# EAGLE design Converter (EAGLE 9.2.2)

## Sheet 1 of 3: Connectors & Caps
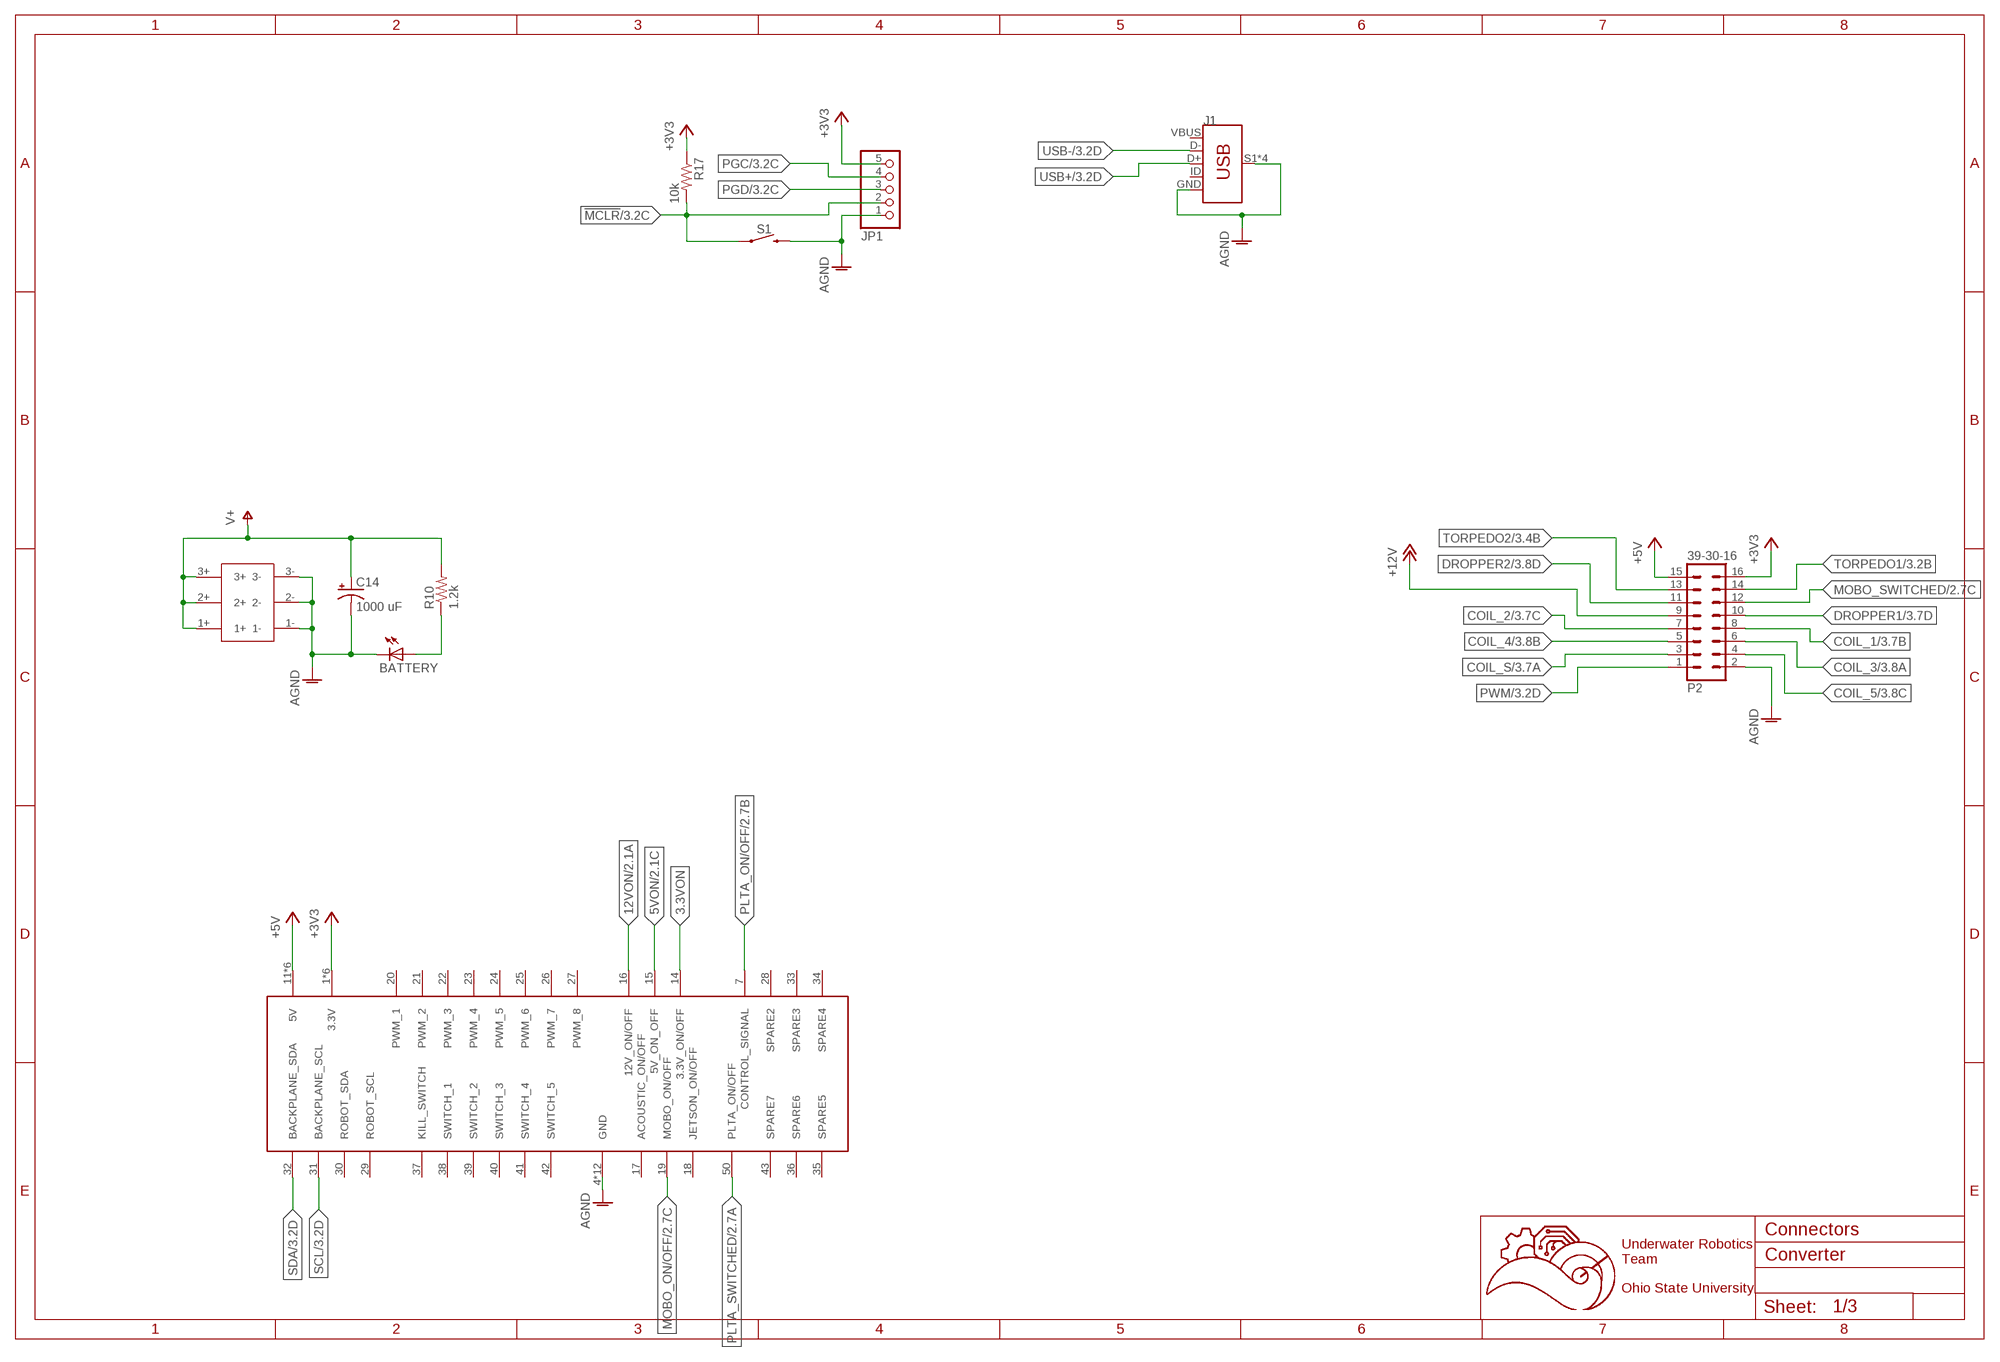
[diagram p0: schematic, sheet 1]

### Parts
BATTERY  LEDCHIPLED_0603  [CHIPLED_0603]
C14  1000 uF  CPOL-USE5-13  [E5-13]
J1  USB_MINI-B_SMT  [USB-MINIB]
JP1  PINHD-1X55X2MM  [1_05X2MM]
P2  39-30-16  [39-30-?16?]
R10  1.2k  R-US_R0805  [R0805]
R17  10k  R-US_R0603  [R0603]
S1  MOMENTARY-SWITCH-SPST-PTH-6.0MM  [TACTILE_SWITCH_PTH_6.0MM]
U$1  5530843-EDGE  [5530843-6-BOARDFINGERS]
U$3  6PIN-VERT  [6PIN_VERT]

### Nets
3.3VON: U$1.14(3.3V_ON/OFF)
5VON: U$1.15(5V_ON_OFF) ; also sheet 2
12VON: U$1.16(12V_ON/OFF) ; also sheet 2
!MCLR!: JP1.2 R17.2 S1.1 ; also sheet 3
+3V3: JP1.5 P2.16 R17.1 U$1.1(3.3V) U$1.2(3.3V) U$1.3(3.3V) U$1.54(3.3V) U$1.55(3.3V) U$1.56(3.3V) ; also sheet 2,3
+5V: P2.15 U$1.11(5V) U$1.12(5V) U$1.13(5V) U$1.44(5V) U$1.45(5V) U$1.46(5V) ; also sheet 2
+12V: P2.9 ; also sheet 2,3
AGND: BATTERY.C C14.- J1.GND J1.S1(SHIELD) J1.S2(SHIELD) J1.S3(SHIELD) J1.S4(SHIELD) JP1.1 P2.2 S1.3 U$1.4(GND) U$1.5(GND) U$1.6(GND) U$1.8(GND) U$1.9(GND) U$1.10(GND) U$1.47(GND) U$1.48(GND) U$1.49(GND) U$1.51(GND) U$1.52(GND) U$1.53(GND) U$3.1- U$3.2- U$3.3- ; also sheet 2,3
COIL_1: P2.8 ; also sheet 3
COIL_2: P2.7 ; also sheet 3
COIL_3: P2.6 ; also sheet 3
COIL_4: P2.5 ; also sheet 3
COIL_5: P2.4 ; also sheet 3
COIL_S: P2.3 ; also sheet 3
DROPPER1: P2.10 ; also sheet 3
DROPPER2: P2.11 ; also sheet 3
MOBO_ON/OFF: U$1.19(MOBO_ON/OFF) ; also sheet 2
MOBO_SWITCHED: P2.12 ; also sheet 2
N$9: BATTERY.A R10.1
PGC: JP1.4 ; also sheet 3
PGD: JP1.3 ; also sheet 3
PLTA_ON/OFF: U$1.7(CONTROL_SIGNAL) ; also sheet 2
PLTA_SWITCHED: U$1.50(PLTA_ON/OFF) ; also sheet 2
PWM: P2.1 ; also sheet 3
SCL: U$1.31(BACKPLANE_SCL) ; also sheet 3
SDA: U$1.32(BACKPLANE_SDA) ; also sheet 3
TORPEDO1: P2.14 ; also sheet 3
TORPEDO2: P2.13 ; also sheet 3
USB+: J1.D+ ; also sheet 3
USB-: J1.D- ; also sheet 3
V+: C14.+ R10.2 U$3.1+ U$3.2+ U$3.3+ ; also sheet 2
Unconnected: J1.ID U$1.17(ACOUSTIC_ON/OFF) U$1.18(JETSON_ON/OFF) U$1.20(PWM_1) U$1.21(PWM_2) U$1.22(PWM_3) U$1.23(PWM_4) U$1.24(PWM_5) U$1.25(PWM_6) U$1.26(PWM_7) U$1.27(PWM_8) U$1.28(SPARE2) U$1.29(ROBOT_SCL) U$1.30(ROBOT_SDA) U$1.33(SPARE3) U$1.34(SPARE4) U$1.35(SPARE5) U$1.36(SPARE6) U$1.37(KILL_SWITCH) U$1.38(SWITCH_1) U$1.39(SWITCH_2) U$1.40(SWITCH_3) U$1.41(SWITCH_4) U$1.42(SWITCH_5) U$1.43(SPARE7)

### Notes on the sheet
- Connectors
- Underwater Robotics
  Team
  
  Ohio State University

## Sheet 2 of 3: Converters
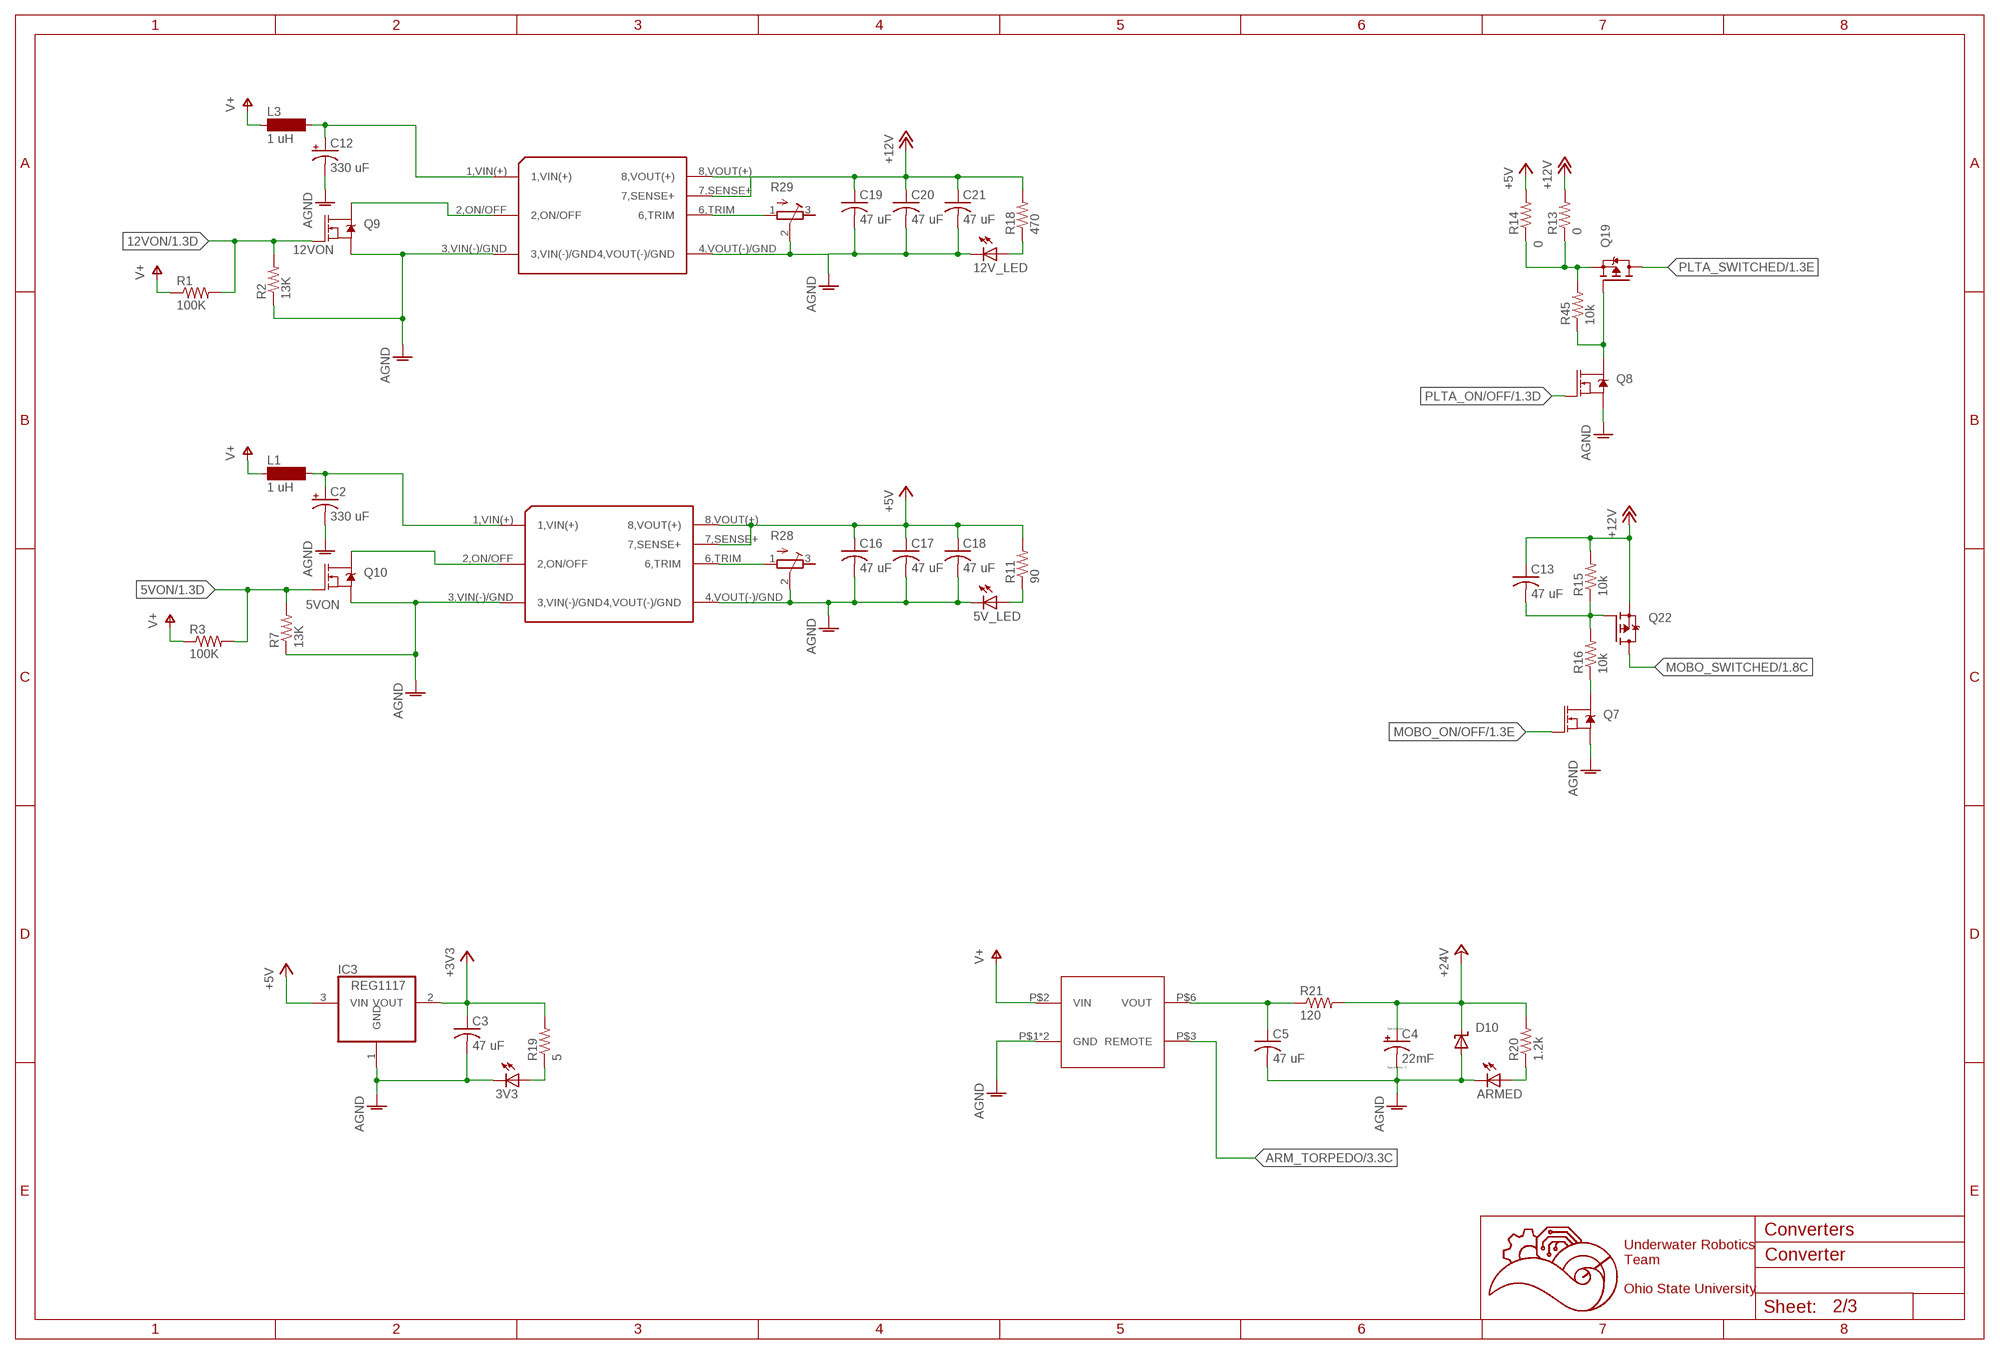
[diagram p1: schematic, sheet 2]

### Parts
3V3  LEDCHIPLED_0603  [CHIPLED_0603]
5V_LED  LEDCHIPLED_0603  [CHIPLED_0603]
5VCONVERTER  CONVERTER  [CONVERTER]
12V_LED  LEDCHIPLED_0603  [CHIPLED_0603]
12VCONVERTER  CONVERTER  [CONVERTER]
ARMED  LEDCHIPLED_0603  [CHIPLED_0603]
C2  330 uF  CPOL-USE5-10.5  [E5-10,5]
C3  47 uF  C-USC1206K  [C1206K]
C4  22mF  CPOL-USE10-30  [EB30D]
C5  47 uF  C-USC1206K  [C1206K]
C12  330 uF  CPOL-USE5-10.5  [E5-10,5]
C13  47 uF  C-USC1206K  [C1206K]
C16  47 uF  C-USC1206K  [C1206K]
C17  47 uF  C-USC1206K  [C1206K]
C18  47 uF  C-USC1206K  [C1206K]
C19  47 uF  C-USC1206K  [C1206K]
C20  47 uF  C-USC1206K  [C1206K]
C21  47 uF  C-USC1206K  [C1206K]
D10  SUPPRESSOR-SMBJ  [SMBJ]
IC3  REG1117  [SOT223]
L1  1 uH  MS85  [MS85]
L3  1 uH  MS85  [MS85]
Q7  MOSFET-NCH-AO3404A  [SOT23-3]
Q8  MOSFET-NCH-AO3404A  [SOT23-3]
Q9  MOSFET-NCH-AO3404A  [SOT23-3]
Q10  MOSFET-NCH-AO3404A  [SOT23-3]
Q19  FDD4141TO252  [TO252]
Q22  FDD4141TO252  [TO252]
R1  100K  R-US_R0603  [R0603]
R2  13K  R-US_R0603  [R0603]
R3  100K  R-US_R0603  [R0603]
R7  13K  R-US_R0603  [R0603]
R11  90  R-US_R0603  [R0603]
R13  0  R-US_M2309  [M2309]
R14  0  R-US_M2309  [M2309]
R15  10k  R-US_R0603  [R0603]
R16  10k  R-US_R0603  [R0603]
R18  470  R-US_R0603  [R0603]
R19  5  R-US_R0603  [R0603]
R20  1.2k  R-US_R0805  [R0805]
R21  120  R-US_R6332W  [R6332W]
R28  R-TRIMM3103  [RTRIM3103]
R29  R-TRIMM3103  [RTRIM3103]
R45  10k  R-US_R0603  [R0603]
U$6  TMR6-2415  [TMR6-2415]

### Nets
5VON: Q10.1(G) R3.2 R7.2 ; also sheet 1
12VON: Q9.1(G) R1.2 R2.2 ; also sheet 1
+3V3: C3.1 IC3.2(VOUT) R19.2 ; also sheet 1,3
+5V: 5VCONVERTER.7,SENSE+ 5VCONVERTER.8,VOUT(+) C16.1 C17.1 C18.1 IC3.3(VIN) R11.2 R14.2 ; also sheet 1
+12V: 12VCONVERTER.7,SENSE+ 12VCONVERTER.8,VOUT(+) C13.1 C19.1 C20.1 C21.1 Q22.2(S) R13.2 R15.2 R18.2 ; also sheet 1,3
+24V: C4.+ D10.C R20.2 R21.2 ; also sheet 3
AGND: 3V3.C 5V_LED.C 5VCONVERTER.3,VIN(-)/GND 5VCONVERTER.4,VOUT(-)/GND 12V_LED.C 12VCONVERTER.3,VIN(-)/GND 12VCONVERTER.4,VOUT(-)/GND ARMED.C C2.- C3.2 C4.- C5.2 C12.- C16.2 C17.2 C18.2 C19.2 C20.2 C21.2 D10.A IC3.1(GND) Q7.2(S) Q8.2(S) Q9.2(S) Q10.2(S) R2.1 R7.1 R28.2(S) R29.2(S) U$6.P$1(GND) U$6.P$7(GND) ; also sheet 1,3
ARM_TORPEDO: U$6.P$3(REMOTE) ; also sheet 3
MOBO_ON/OFF: Q7.1(G) ; also sheet 1
MOBO_SWITCHED: Q22.3(D) ; also sheet 1
N$1: 12VCONVERTER.6,TRIM R29.1(A)
N$2: 5VCONVERTER.6,TRIM R28.1(A)
N$3: 12VCONVERTER.1,VIN(+) C12.+ L3.2
N$5: 3V3.A R19.1
N$6: 5V_LED.A R11.1
N$7: 5VCONVERTER.1,VIN(+) C2.+ L1.2
N$8: 12V_LED.A R18.1
N$10: ARMED.A R20.1
N$11: C13.2 Q22.1(G) R15.1 R16.2
N$12: Q7.3(D) R16.1
N$13: Q19.2(S) R13.1 R14.1 R45.2
N$16: Q8.3(D) Q19.1(G) R45.1
N$18: 12VCONVERTER.2,ON/OFF Q9.3(D)
N$19: 5VCONVERTER.2,ON/OFF Q10.3(D)
N$26: C5.1 R21.1 U$6.P$6(VOUT)
PLTA_ON/OFF: Q8.1(G) ; also sheet 1
PLTA_SWITCHED: Q19.3(D) ; also sheet 1
V+: L1.1 L3.1 R1.1 R3.1 U$6.P$2(VIN) ; also sheet 1
Unconnected: R28.3(E) R29.3(E)

### Notes on the sheet
- Converters
- Underwater Robotics
  Team
  
  Ohio State University
- C:/Users/blain/Downloads/Black and White.bmp

## Sheet 3 of 3: Actuators
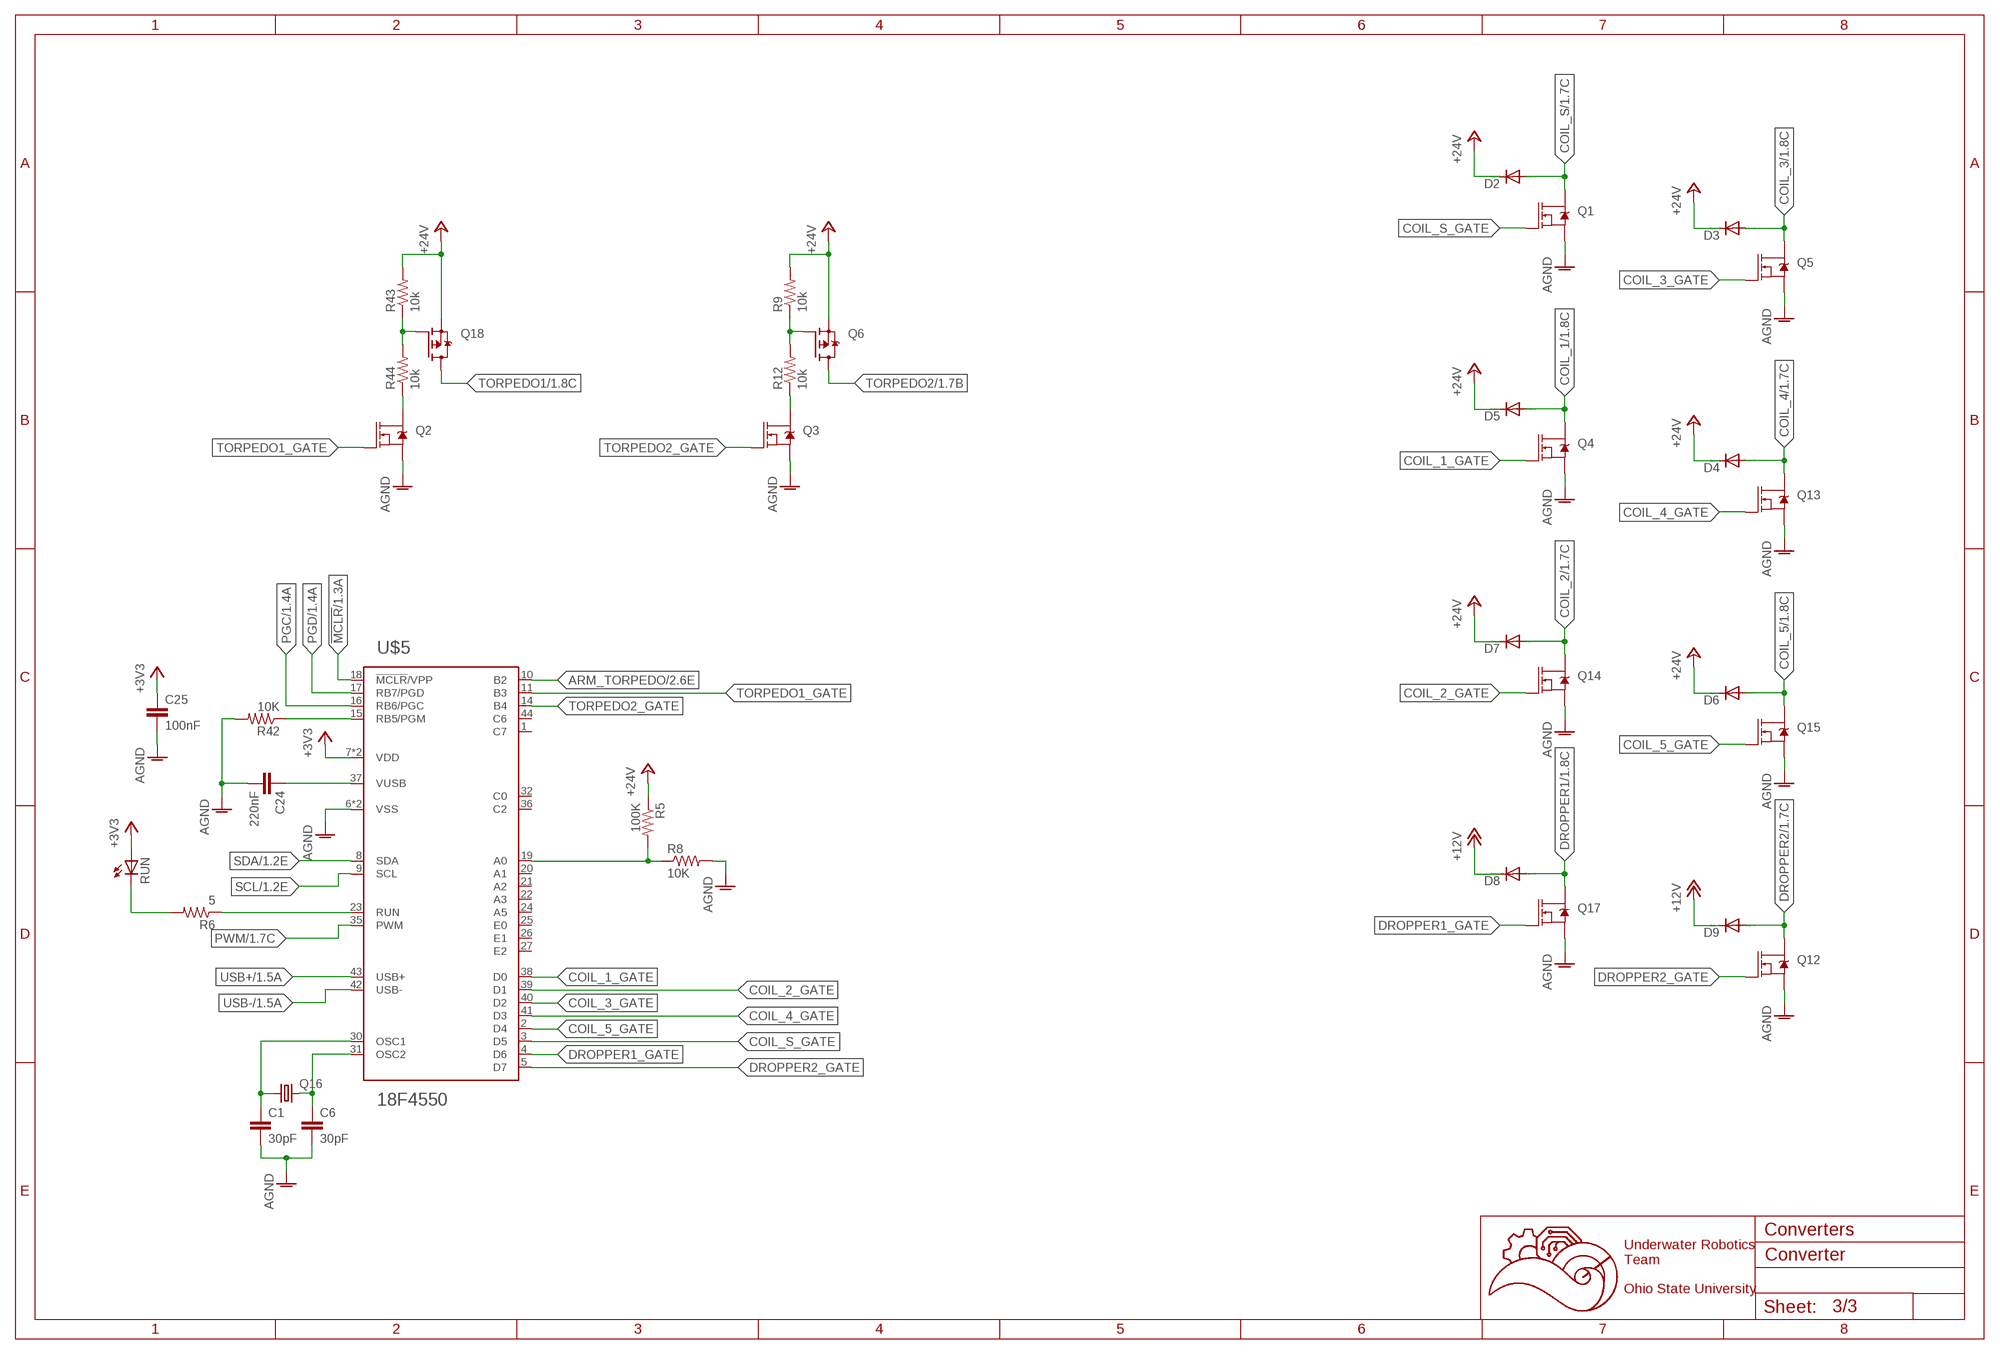
[diagram p2: schematic, sheet 3]

### Parts
C1  30pF  C-EUC0603  [C0603]
C6  30pF  C-EUC0603  [C0603]
C24  220nF  C-EUC0603  [C0603]
C25  100nF  C-EUC0603  [C0603]
D2  DIODE-SMB  [SMB]
D3  DIODE-SMB  [SMB]
D4  DIODE-SMB  [SMB]
D5  DIODE-SMB  [SMB]
D6  DIODE-SMB  [SMB]
D7  DIODE-SMB  [SMB]
D8  DIODE-SMB  [SMB]
D9  DIODE-SMB  [SMB]
Q1  MOSFET-NCH-AO3404A  [SOT23-3]
Q2  MOSFET-NCH-AO3404A  [SOT23-3]
Q3  MOSFET-NCH-AO3404A  [SOT23-3]
Q4  MOSFET-NCH-AO3404A  [SOT23-3]
Q5  MOSFET-NCH-AO3404A  [SOT23-3]
Q6  FDD4141TO252  [TO252]
Q12  MOSFET-NCH-AO3404A  [SOT23-3]
Q13  MOSFET-NCH-AO3404A  [SOT23-3]
Q14  MOSFET-NCH-AO3404A  [SOT23-3]
Q15  MOSFET-NCH-AO3404A  [SOT23-3]
Q16  CRYSTALHC49UP  [HC49UP]
Q17  MOSFET-NCH-AO3404A  [SOT23-3]
Q18  FDD4141TO252  [TO252]
R5  100K  R-US_R0603  [R0603]
R6  5  R-US_R0603  [R0603]
R8  10K  R-US_R0603  [R0603]
R9  10k  R-US_R0603  [R0603]
R12  10k  R-US_R0603  [R0603]
R42  10K  R-US_R0603  [R0603]
R43  10k  R-US_R0603  [R0603]
R44  10k  R-US_R0603  [R0603]
RUN  LEDCHIPLED_0603  [CHIPLED_0603]
U$5  18F4550  [TQFP-44A-44]

### Nets
!MCLR!: U$5.18(!MCLR!/VPP) ; also sheet 1
+3V3: C25.1 RUN.A U$5.7(VDD) U$5.28(VDD) ; also sheet 1,2
+12V: D8.C D9.C ; also sheet 1,2
+24V: D2.C D3.C D4.C D5.C D6.C D7.C Q6.2(S) Q18.2(S) R5.1 R9.2 R43.2 ; also sheet 2
AGND: C1.2 C6.2 C24.2 C25.2 Q1.2(S) Q2.2(S) Q3.2(S) Q4.2(S) Q5.2(S) Q12.2(S) Q13.2(S) Q14.2(S) Q15.2(S) Q17.2(S) R8.2 R42.2 U$5.6(VSS) U$5.29(VSS) ; also sheet 1,2
ARM_TORPEDO: U$5.10(B2) ; also sheet 2
COIL_1: D5.A Q4.3(D) ; also sheet 1
COIL_1_GATE: Q4.1(G) U$5.38(D0)
COIL_2: D7.A Q14.3(D) ; also sheet 1
COIL_2_GATE: Q14.1(G) U$5.39(D1)
COIL_3: D3.A Q5.3(D) ; also sheet 1
COIL_3_GATE: Q5.1(G) U$5.40(D2)
COIL_4: D4.A Q13.3(D) ; also sheet 1
COIL_4_GATE: Q13.1(G) U$5.41(D3)
COIL_5: D6.A Q15.3(D) ; also sheet 1
COIL_5_GATE: Q15.1(G) U$5.2(D4)
COIL_S: D2.A Q1.3(D) ; also sheet 1
COIL_S_GATE: Q1.1(G) U$5.3(D5)
DROPPER1: D8.A Q17.3(D) ; also sheet 1
DROPPER1_GATE: Q17.1(G) U$5.4(D6)
DROPPER2: D9.A Q12.3(D) ; also sheet 1
DROPPER2_GATE: Q12.1(G) U$5.5(D7)
N$4: R5.2 R8.1 U$5.19(A0)
N$14: Q2.3(D) R44.1
N$15: R6.2 RUN.C
N$20: Q18.1(G) R43.1 R44.2
N$22: C6.1 Q16.2 U$5.31(OSC2)
N$23: C1.1 Q16.1 U$5.30(OSC1)
N$24: R6.1 U$5.23(RUN)
N$25: Q6.1(G) R9.1 R12.2
N$28: Q3.3(D) R12.1
N$32: C24.1 U$5.37(VUSB)
N$33: R42.1 U$5.15(RB5/PGM)
PGC: U$5.16(RB6/PGC) ; also sheet 1
PGD: U$5.17(RB7/PGD) ; also sheet 1
PWM: U$5.35(PWM) ; also sheet 1
SCL: U$5.9(SCL) ; also sheet 1
SDA: U$5.8(SDA) ; also sheet 1
TORPEDO1: Q18.3(D) ; also sheet 1
TORPEDO1_GATE: Q2.1(G) U$5.11(B3)
TORPEDO2: Q6.3(D) ; also sheet 1
TORPEDO2_GATE: Q3.1(G) U$5.14(B4)
USB+: U$5.43(USB+) ; also sheet 1
USB-: U$5.42(USB-) ; also sheet 1
Unconnected: U$5.1(C7) U$5.20(A1) U$5.21(A2) U$5.22(A3) U$5.24(A5) U$5.25(E0) U$5.26(E1) U$5.27(E2) U$5.32(C0) U$5.36(C2) U$5.44(C6)

### Notes on the sheet
- Converters
- Underwater Robotics
  Team
  
  Ohio State University
- C:/Users/blain/Downloads/Black and White.bmp

## Power pins joined to a net without a drawn wire
VBUS: J1.VBUS

## Library data of the parts
3V3 5V_LED 12V_LED ARMED BATTERY RUN = led:LED: LED OSRAM: - CHIPLED LG R971, LG N971, LY N971, LG Q971, LY Q971, LO R971, LY R971 LH N974, LH R974 LS Q976, LO Q976, LY Q976 LO Q996 - Hyper CHIPLED LW Q18S LB Q993, LB Q99A, LB R99A - SideLED LS A670, LO A670, LY A670, LG A670, LP A670 LB A673, LV A673, LT A673, LW A673 LH A674 LY A675 LS A676, LA A676, LO A676, LY A676, LW A676 LS A679, LY A679, LG A679 - Hyper Micro SIDELED® LS Y876, LA Y876, LO Y876, LY Y876 LT Y87S - SmartLED LW L88C, LW L88S LB L89C, LB L89S, LG L890 LS L89K, LO L89K, LY L89K LS L896, LA L896, LO L896, LY L896 - TOPLED LS T670, LO T670, LY T670, LG T670, LP T670 LSG T670, LSP T670, LSY T670, LOP T670, LYG T670 LG T671, LOG T671, LSG T671 LB T673, LV T673, LT T673, LW T673 LH T674 LS T676, LA T676, LO T676, LY T676, LB T676, LH T676, LSB T676, LW T676 LB T67C, LV T67C, LT T67C, LS T67K, LO T67K, LY T67K, LW E67C LS E67B, LA E67B, LO E67B, LY E67B, LB E67C, LV E67C, LT E67C LW T67C LS T679, LY T679, LG T679 LS T770, LO T770, LY T770, LG T770, LP T770 LB T773, LV T773, LT T773, LW T773 LH T774 LS E675, LA E675, LY E675, LS T675 LS T776, LA T776, LO T776, LY T776, LB T776 LHGB T686 LT T68C, LB T68C - Hyper Mini TOPLED® LB M676 - Mini TOPLED Santana® LG M470 LS M47K, LO M47K, LY M47K Source: http://www.osram.convergy.de LUXEON: - LUMILED® LXK2-PW12-R00, LXK2-PW12-S00, LXK2-PW14-U00, LXK2-PW14-V00 LXK2-PM12-R00, LXK2-PM12-S00, LXK2-PM14-U00 LXK2-PE12-Q00, LXK2-PE12-R00, LXK2-PE12-S00, LXK2-PE14-T00, LXK2-PE14-U00 LXK2-PB12-K00, LXK2-PB12-L00, LXK2-PB12-M00, LXK2-PB14-N00, LXK2-PB14-P00, LXK2-PB14-Q00 LXK2-PR12-L00, LXK2-PR12-M00, LXK2-PR14-Q00, LXK2-PR14-R00 LXK2-PD12-Q00, LXK2-PD12-R00, LXK2-PD12-S00 LXK2-PH12-R00, LXK2-PH12-S00 LXK2-PL12-P00, LXK2-PL12-Q00, LXK2-PL12-R00 Source: www.luxeon.com KINGBRIGHT: KA-3528ASYC Source: www.kingbright.com
5VCONVERTER 12VCONVERTER = converter:CONVERTER
C1 C6 C24 C25 = rcl:C-EU: CAPACITOR, European symbol; SPICEPREFIX: C
C2 C12 C14 = rcl:CPOL-US: POLARIZED CAPACITOR, American symbol; SPICEPREFIX: C
C3 C5 C13 C16-C21 = resistor:C-US: CAPACITOR, American symbol
C4 = resistor:CPOL-US: POLARIZED CAPACITOR, American symbol
D2-D9 = diode:DIODE-: DIODE
D10 = diode:SUPPRESSOR-: Suppressor diode
IC3 = burr-brown:REG1117: 800mA and 1A Low Dropout (LDO) Positive Regulator 1.8V, 2.5V, 2.85V, 3.3V, 5V, and Adj; MPN: REG1117; OC_FARNELL: 1097566; OC_NEWARK: 14P6981
J1 = SparkFun-Connectors:USB_MINI-B: USB type Mini-B Connector Breaks out 5th pin, and includes shield pins if needed. SparkFun Products: SparkFun FTDI Basic Breakout <https://www.sparkfun.com/products/9716> SparkFun XBee Explorer USB <https://www.sparkfun.com/products/11812> SparkFun Redboard <https://www.sparkfun.com/products/12757>; PROD_ID: CONN-08193; SF_ID: PRT-00587
JP1 = pinhead:PINHD-1X5: PIN HEADER
L1 L3 = inductor-neosid:MS85: INDUCTOR SMD power inductor; OC_FARNELL: unknown; OC_NEWARK: unknown
P2 = con-molex-mini-fit:39-30-?16?: HEADER
Q1-Q5 Q7-Q10 Q12-Q15 Q17 = SparkFun-DiscreteSemi:MOSFET-NCH: N-channel MOSFETs Voltage controlled devices that allow control of high current outputs. SparkFun Products: SparkFun OpenScale <https://www.sparkfun.com/products/13261> SparkFun Digital Sandbox <https://www.sparkfun.com/products/12651> SparkFun Monster Moto Shield <https://www.sparkfun.com/products/10182> SparkFun MOSFET Power Controller <https://www.sparkfun.com/products/11214>; PROD_ID: TRANS-12988; VALUE: 5.8A/30V/35mΩ
Q6 Q18 Q19 Q22 = transistor-fet:FDD4141: P-Channel PowerTrench® MOSFET Source: FDD4141.pdf
Q16 = crystal:CRYSTAL: CRYSTAL; OC_FARNELL: unknown; OC_NEWARK: unknown
R1-R3 R5-R8 R11 R17-R19 R42 = rcl:R-US_: RESISTOR, American symbol; SPICEPREFIX: R
R9 R10 R12-R16 R20 R21 R43-R45 = resistor:R-US_: RESISTOR, American symbol
R28 R29 = rcl:R-TRIMM: Trimm resistor; SPICEMODEL: X; SPICEPREFIXL: POT
S1 = SparkFun-Switches:MOMENTARY-SWITCH-SPST: Momentary Switch (Pushbutton) - SPST Normally-open (NO) SPST momentary switches (buttons, pushbuttons). Variants PTH-12MM - 12mm square, through-hole Momentary Pushbutton Switch - 12mm Square <https://www.sparkfun.com/products/9190> (COM-09190) PTH-6.0MM, PTH-6.0MM-KIT - 6.0mm square, through-hole Mini Pushbutton Switch <https://www.sparkfun.com/products/97> (COM-00097) KIT package intended for soldering kit's - only one side of pads' copper is exposed. PTH-RIGHT-ANGLE-KIT - Right-angle, through-hole Right Angle Tactile Button <https://www.sparkfun.com/products/10791> - Used on SparkFun BigTime Watch Kit <https://www.sparkfun.com/products/11734> SMD-12MM - 12mm square, surface-mount Tactile Button - SMD (12mm) <https://www.sparkfun.com/products/12993> (COM-12993) Used on SparkFun PicoBoard <https://www.sparkfun.com/products/11888> SMD-4.5MM - 4.5mm Square Trackball Switch Used on SparkFun Blackberry Trackballer Breakout <https://www.sparkfun.com/products/13169> SMD-4.6MMX2.8MM - 4.60mm x 2.80mm, surface mount Used on SparkFun SAMD21 Mini Breakout <https://www.sparkfun.com/products/13664> SMD-5.2MM, SMD-5.2-REDUNDANT - 5.2mm square, surface-mount Mini Pushbutton Switch - SMD <https://www.sparkfun.com/products/8720> (COM-08720) Used on Arduino Pro Mini <https://www.sparkfun.com/products/11114> REDUNDANT package connects both switch circuits together SMD-6.0X3.5MM - 6.0 x 3.5mm, surface mount Momentary Reset Switch SMD <https://www.sparkfun.com/products/8229> (COM-08229) SMD-6.2MM-TALL - 6.2mm square, surface mount Tactile Button - SMD (6mm) <https://www.sparkfun.com/products/12992> Used on SparkFun Digital Sandbox <https://www.sparkfun.com/products/12651> SMD-RIGHT-ANGLE - Right-angle, surface mount Used on SparkFun Block for Intel® Edison - Arduino <https://www.sparkfun.com/products/13036>; PROD_ID: SWCH-08441; SF_SKU: COM-00097
U$1 = 5530843-6:5530843-EDGE
U$3 = Vertical_Connectors:6PIN-VERT
U$5 = 18f4550:18F4550
U$6 = converter:TMR6-2415

## Board
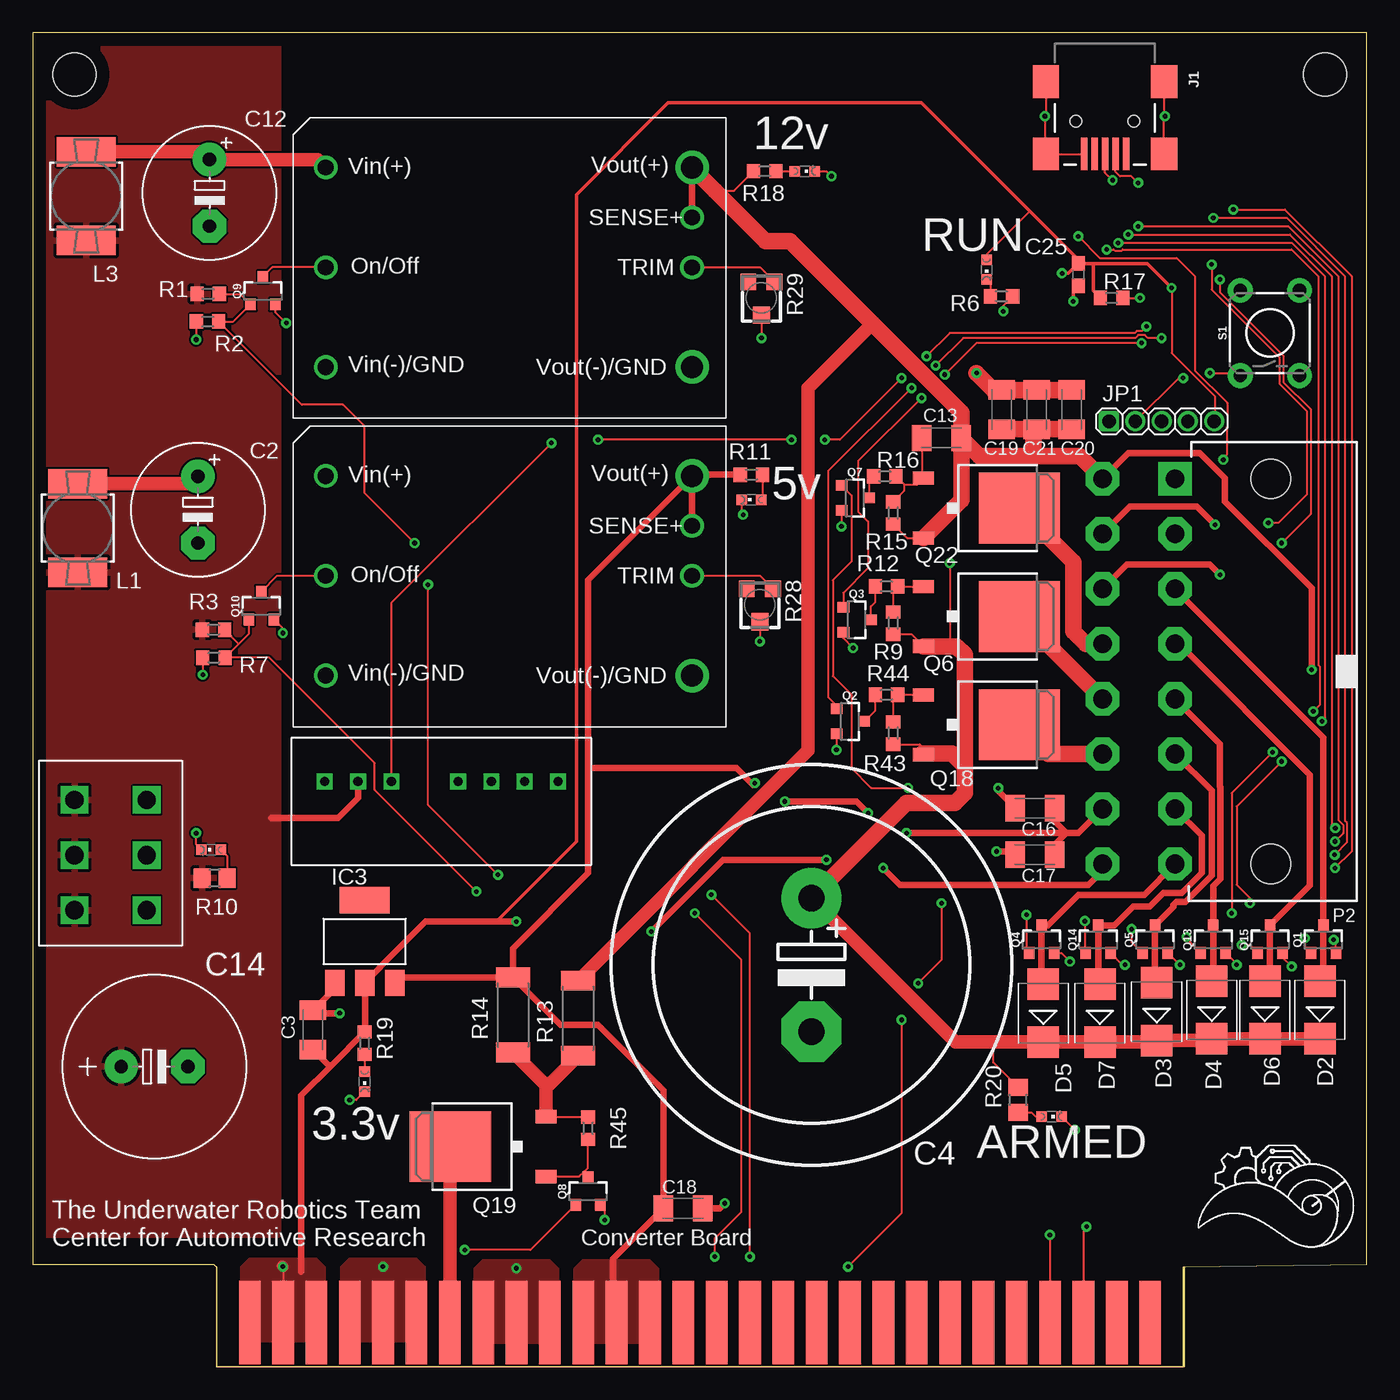
[diagram p3: board, top side]
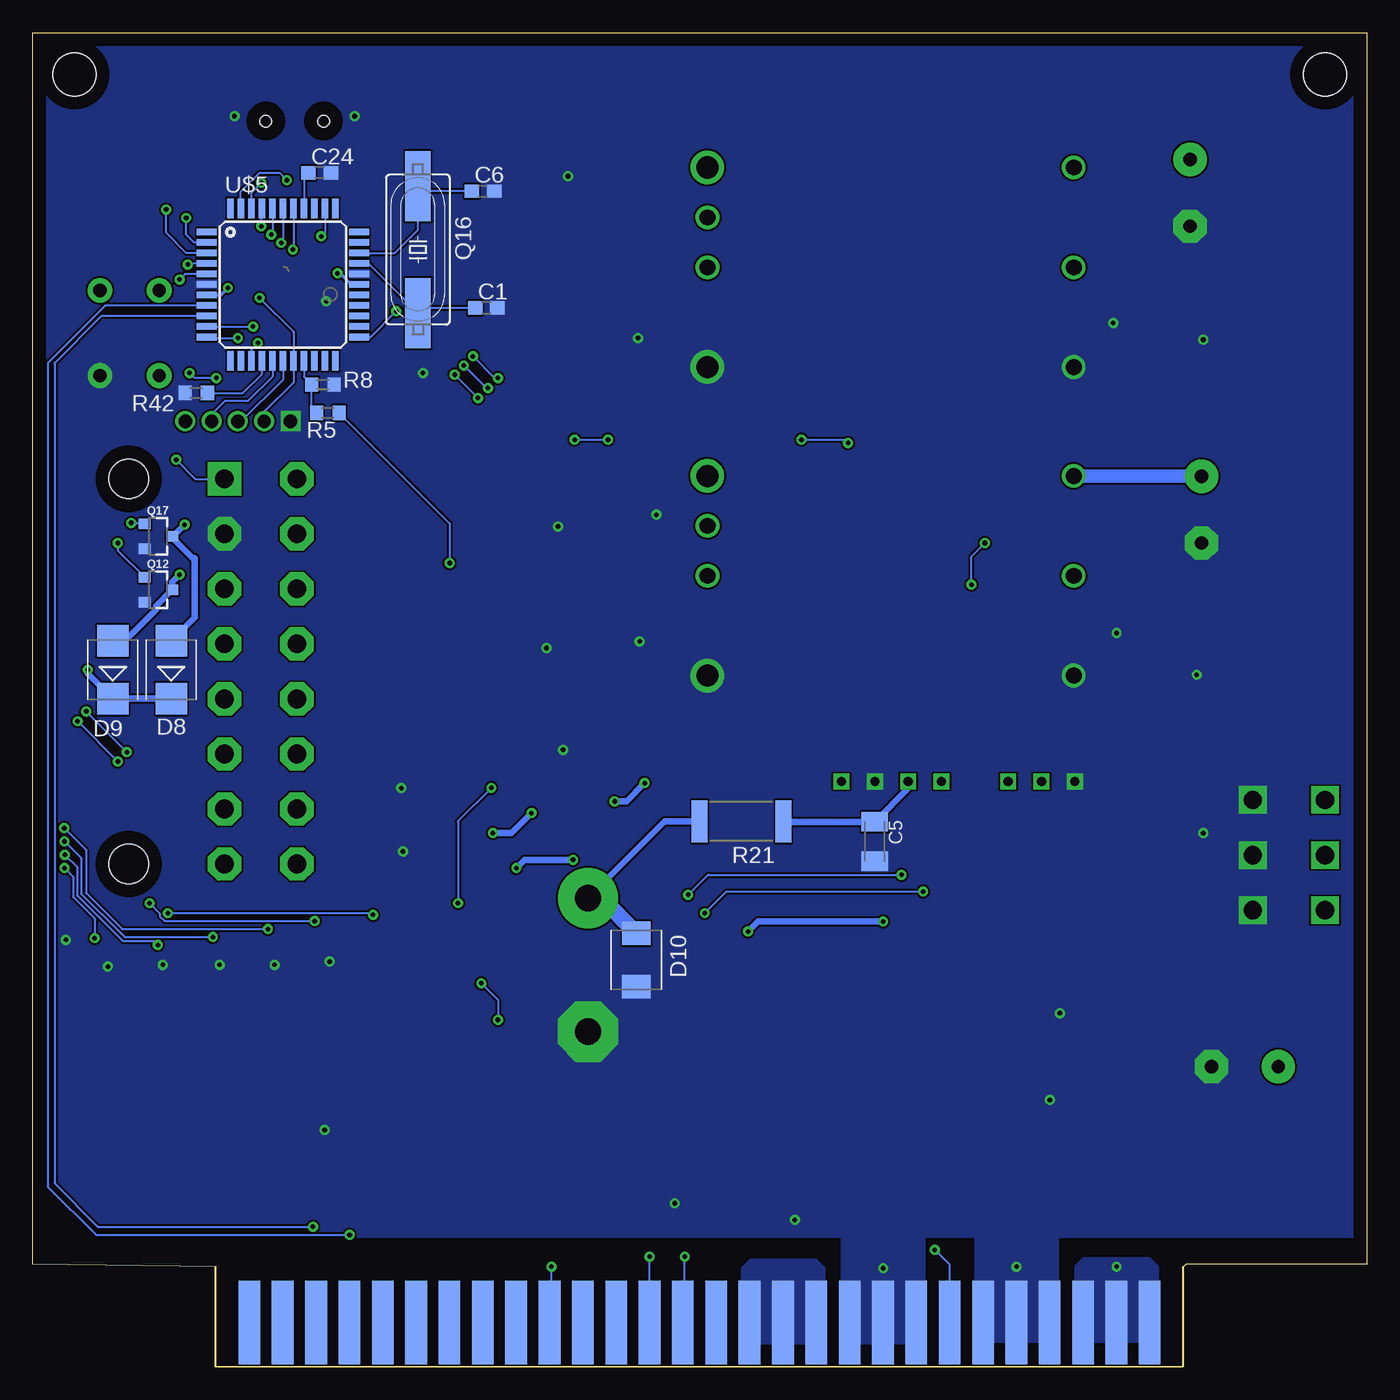
[diagram p4: board, bottom side, seen from below]

Size 101.6 x 101.6 mm. Coordinates in mm from the lower left corner, seen from the top.
Outline: 0,7.8 13.79,7.8 13.97,7.62 13.97,0 87.63,0 87.63,7.62 101.6,7.8 101.6,101.6 0,101.6 0,7.8
Copper layers (1*16): Top 0.035mm / dielectric 1.5mm / Bottom 0.035mm
Design rules "default": minimum track width 6mil, minimum drill 0.35mm, track to track 6mil, track to pad 6mil, pad to pad 6mil, via to via 6mil, smd to smd 6mil, copper to edge 40mil, drill to drill 6mil, minimum pad ring 10mil, minimum via ring 8mil, stop-mask expansion 4mil, vias tented up to drill 0mil, thermal gap 10mil
Holes 3.26 mm at 3.17,98.42 98.42,98.42

### Footprints (pad centres in the part's own frame; a part is rotated, then mirrored left to right if it is on the bottom)
CHIPLED_0603 = smd 0.8 x 0.8: A 0,-0.75; C 0,0.75
CONVERTER = drill 1.2: 1,VIN(+) 2.5,19.1; 2,ON/OFF 2.5,11.5; 3,VIN(-)/GND 2.5,3.9; 6,TRIM 30.4,11.5; 7,SENSE+ 30.4,15.3 | drill 1.7: 4,VOUT(-)/GND 30.4,3.9; 8,VOUT(+) 30.4,19.1
C0603 = smd 1.1 x 1: 1 -0.85,0; 2 0.85,0
E5-10,5 = drill 1.016 pad 2.54: + -2.54,0 | drill 1.016 pad 2.54 octagon: - 2.54,0
C1206K = smd 1.5 x 2: 1 -1.5,0; 2 1.5,0
EB30D = drill 2.007 pad 4.597: + -5.08,0 | drill 2.007 pad 4.597 octagon: - 5.08,0
E5-13 = drill 1.016 pad 2.54: + -2.54,0 | drill 1.016 pad 2.54 octagon: - 2.54,0
SMB = smd 2.4 x 2.4: A 2.2,0; C -2.2,0
SMBJ = smd 1.78 x 2.16: A 2.04,0; C -2.03,0
SOT223 = smd 1.499 x 2.007: 1 -2.261,-3.15; 2 0.025,-3.15; 3 2.311,-3.15 | smd 3.81 x 2.007: 4 0,3.15
USB-MINIB = smd 2.5 x 0.5: D+ 2.5,0; D- 2.5,0.8; GND 2.5,-1.6; ID 2.5,-0.8; VBUS 2.5,1.6 | smd 2.5 x 2: S1 -3,4.5; S2 2.5,4.5; S3 -3,-4.5; S4 2.5,-4.5 | hole 0.9: 0,2.2; 0,-2.2
1_05X2MM = drill 1.016 pad 1.3 square: 1 -4,0 | drill 1.016 pad 1.3: 2 -2,0; 3 0,0; 4 2,0; 5 4,0
MS85 = smd 4.5 x 2.25: 1 0,-3.383; 2 0,3.383
39-30-?16? = drill 1.422 pad 2.54 square: 1 14.668,0 | drill 1.422 pad 2.54 octagon: 2 10.477,0; 3 6.287,0; 4 2.095,0; 5 -2.095,0; 6 -6.287,0; 7 -10.477,0; 8 -14.668,0; 9 14.668,5.512; 10 10.477,5.512; 11 6.287,5.512; 12 2.095,5.512; 13 -2.095,5.512; 14 -6.287,5.512; 15 -10.477,5.512; 16 -14.668,5.512 | hole 3: -14.668,-7.3; 14.668,-7.3
SOT23-3 = smd 0.8 x 0.9: 1 -0.95,-1; 2 0.95,-1; 3 0,1.1
TO252 = smd 1 x 1.6: 1 -2.28,-4.8; 2 2.28,-4.8 | smd 5.4 x 6.2: 3 0,2.5
HC49UP = smd 5.334 x 1.93: 1 -4.826,0; 2 4.826,0
R0603 = smd 1 x 1.1: 1 -0.85,0; 2 0.85,0
R0805 = smd 1.3 x 1.5: 1 -0.95,0; 2 0.95,0
M2309 = smd 1.5 x 2.6: 1 -2.85,0; 2 2.85,0
R6332W = smd 1.2 x 3.2: 1 -3.196,0; 2 3.196,0
RTRIM3103 = smd 1.2 x 1.25: 1 -1,-1.225; 3 1,-1.225 | smd 1.3 x 1.3: 2 0,1.3
TACTILE_SWITCH_PTH_6.0MM = drill 1.016 pad 1.88: 1 -3.251,2.261; 2 3.251,2.261; 3 -3.251,-2.261; 4 3.251,-2.261
5530843-6-BOARDFINGERS = smd 1.651 x 6.35 bottom: 1 0.826,3.375; 2 3.365,3.375; 3 5.905,3.375; 4 8.445,3.375; 5 10.986,3.375; 6 13.525,3.375; 7 16.066,3.375; 8 18.605,3.375; 9 21.145,3.375; 10 23.686,3.375; 11 26.226,3.375; 12 28.765,3.375; 13 31.305,3.375; 14 33.846,3.375; 15 36.386,3.375; 16 38.925,3.375; 17 41.465,3.375; 18 44.005,3.375; 19 46.545,3.375; 20 49.086,3.375; 21 51.626,3.375; 22 54.166,3.375; 23 56.706,3.375; 24 59.245,3.375; 25 61.785,3.375; 26 64.326,3.375; 27 66.865,3.375; 28 69.406,3.375 | smd 1.651 x 6.35: 29 69.406,3.375; 30 66.865,3.375; 31 64.326,3.375; 32 61.785,3.375; 33 59.245,3.375; 34 56.706,3.375; 35 54.166,3.375; 36 51.626,3.375; 37 49.086,3.375; 38 46.545,3.375; 39 44.005,3.375; 40 41.465,3.375; 41 38.925,3.375; 42 36.386,3.375; 43 33.846,3.375; 44 31.305,3.375; 45 28.765,3.375; 46 26.226,3.375; 47 23.686,3.375; 48 21.145,3.375; 49 18.605,3.375; 50 16.066,3.375; 51 13.525,3.375; 52 10.986,3.375; 53 8.445,3.375; 54 5.905,3.375; 55 3.365,3.375; 56 0.826,3.375
6PIN_VERT = drill 1.4 square: 1+ 0,0; 1- 5.5,0; 2+ 0,4.2; 2- 5.5,4.2; 3+ 0,8.4; 3- 5.5,8.4
TQFP-44A-44 = smd 1.5 x 0.5: 1 -5.8,4; 2 -5.8,3.2; 3 -5.8,2.4; 4 -5.8,1.6; 5 -5.8,0.8; 6 -5.8,0; 7 -5.8,-0.8; 8 -5.8,-1.6; 9 -5.8,-2.4; 10 -5.8,-3.2; 11 -5.8,-4; 23 5.8,-4; 24 5.8,-3.2; 25 5.8,-2.4; 26 5.8,-1.6; 27 5.8,-0.8; 28 5.8,0; 29 5.8,0.8; 30 5.8,1.6; 31 5.8,2.4; 32 5.8,3.2; 33 5.8,4 | smd 0.5 x 1.5: 12 -4,-5.8; 13 -3.2,-5.8; 14 -2.4,-5.8; 15 -1.6,-5.8; 16 -0.8,-5.8; 17 0,-5.8; 18 0.8,-5.8; 19 1.6,-5.8; 20 2.4,-5.8; 21 3.2,-5.8; 22 4,-5.8; 34 4,5.8; 35 3.2,5.8; 36 2.4,5.8; 37 1.6,5.8; 38 0.8,5.8; 39 0,5.8; 40 -0.8,5.8; 41 -1.6,5.8; 42 -2.4,5.8; 43 -3.2,5.8; 44 -4,5.8
TMR6-2415 = drill 0.7 square: P$1 0,0; P$2 2.54,0; P$3 5.08,0; P$5 10.16,0; P$6 12.7,0; P$7 15.24,0; P$8 17.78,0

### Placement (x,y rotation side)
3V3  25.27,21.72 180 top
5V_LED  54.74,66.04 90 top
5VCONVERTER  19.81,48.74 0 top
12V_LED  58.8,91.06 270 top
12VCONVERTER  19.81,72.24 0 top
ARMED  77.6,19.05 270 top
BATTERY  13.59,39.37 90 top
C1  67.06,80.64 0 bottom
C2  12.57,65.28 270 top
C3  21.34,25.65 90 top
C4  59.31,30.61 270 top
C5  37.47,40.01 270 bottom
C6  67.31,89.53 0 bottom
C12  13.46,89.41 270 top
C13  69.22,70.74 180 top
C14  9.27,22.86 0 top
C16  76.33,42.55 180 top
C17  76.33,38.99 180 top
C18  49.53,12.06 0 top
C19  73.79,72.9 90 top
C20  79.12,72.9 90 top
C21  76.45,72.9 90 top
C24  79.76,90.93 0 bottom
C25  79.63,83.19 270 top
D2  98.04,27.18 90 top
D3  85.6,27.05 90 top
D4  89.79,27.18 90 top
D5  76.96,26.92 90 top
D6  93.85,27.18 90 top
D7  81.28,26.92 90 top
D8  91.06,53.09 90 bottom
D9  95.5,53.09 90 bottom
D10  55.63,30.99 270 bottom
IC3  25.27,32.38 0 top
J1  81.66,94.87 270 top
JP1  85.98,72.01 0 top
L1  3.43,63.88 0 top
L3  4.06,89.15 0 top
P2  39-30-16?  [39-30-?16?]  87,52.96 90 top
Q1  98.3,32.51 0 top
Q2  62.23,49.15 270 top
Q3  62.74,56.9 270 top
Q4  76.83,32.51 0 top
Q5  85.47,32.51 0 top
Q6  72.64,57.15 270 top
Q7  62.61,66.17 270 top
Q8  42.29,13.34 0 top
Q9  17.53,81.92 0 top
Q10  17.4,57.91 0 top
Q12  92.08,59.18 270 bottom
Q13  89.92,32.51 0 top
Q14  81.15,32.51 0 top
Q15  94.23,32.51 0 top
Q16  72.26,85.09 90 bottom
Q17  92.08,63.25 270 bottom
Q18  72.64,48.9 270 top
Q19  34.29,16.76 90 top
Q22  72.64,65.41 270 top
R1  13.36,81.71 0 top
R2  13.31,79.6 0 top
R3  13.77,56.13 0 top
R5  79.12,72.64 180 bottom
R6  73.79,81.53 180 top
R7  13.79,54 0 top
R8  79.5,74.8 0 bottom
R9  65.53,56.64 270 top
R10  13.84,37.21 180 top
R11  54.74,67.94 180 top
R12  65.02,59.44 0 top
R13  41.53,26.54 90 top
R14  36.58,26.8 90 top
R15  65.53,65.02 270 top
R16  64.9,67.82 0 top
R17  82.17,81.41 0 top
R18  55.75,91.06 180 top
R19  25.27,24.64 90 top
R20  75.06,20.32 90 top
R21  47.62,41.53 180 bottom
R28  55.37,58.04 180 top
R29  55.5,81.41 180 top
R42  89.15,74.17 180 bottom
R43  65.53,48.26 270 top
R44  65.02,51.18 0 top
R45  42.29,18.16 90 top
RUN  72.64,83.57 180 top
S1  94.23,78.74 90 top
U$1  15.7,0 0 top
U$3  3.17,34.77 0 top
U$5  82.55,82.42 0 bottom
U$6  22.23,44.58 0 top

### Tracks (layer width: path | path; a pad name or v marks a point on that pad's centre or on a via)
5VON  (via drill 0.35)
  Top 0.152: v51.94,8.38 51.94,9.78 53.98,11.81 53.98,30.99 v50.42,34.54 | v33.78,36.2 26.04,43.94 26.04,45.97 18.01,54 R7.2 15.69,55.05 | Q10.1 16.45,55.81 15.69,55.05 | 15.69,55.05 15.69,55.06 R3.2
  Bottom 0.152: U$1.15 52.58,3.87 51.94,4.5 v51.94,8.38 | v50.42,34.54 48.77,36.2 v33.78,36.2
12VON  (via drill 0.35)
  Top 0.152: v54.61,8.38 54.61,33.02 v51.69,35.94 | v35.43,37.47 30.1,42.8 v30.1,59.56 | v29.08,62.74 25.27,66.55 25.27,71.63 23.62,73.28 20.48,73.28 R2.2 15.27,79.6 Q9.1 15.78,81.71 R1.2
  Bottom 0.152: U$1.16 54.61,3.39 v54.61,8.38 | v51.69,35.94 50.16,37.47 v35.43,37.47 | v30.1,59.56 30.1,61.72 v29.08,62.74
!MCLR!  (via drill 0.35)
  Top 0.152: R17.2 v84.33,81.41 | JP1.2 87.28,75.31 v87.63,75.31 | v89.66,75.69 91.77,75.69 S1.1
  Bottom 0.152: v84.33,81.41 81.75,78.83 U$5.18 81.75,74.97 83.98,72.74 JP1.2 | v87.63,75.31 89.28,75.31 v89.66,75.69
+3V3  (via drill 0.35)
  Top 0.152: v19.05,7.62 19.05,3.39 U$1.55 | v86.74,82.17 86.74,77.22 90.04,73.91 90.04,72.07 JP1.5 | RUN.A 72.64,84.71 75.95,88.01
  Top 0.254: 35.31,33.91 41.4,40.01 41.4,89.28 48.39,96.27 67.69,96.27 75.95,88.01 79.63,84.33 C25.1 | C25.1 78.87,83.28 v78.39,83.28 | C25.1 80.77,84.03 | 80.77,84.03 84.88,84.03 v86.74,82.17 | 80.77,84.03 80.77,81.95 R17.1
  Top 0.508: 22.75,22.97 R19.2 25.3,25.51 IC3.2 26.43,30.37 26.43,30.41 29.93,33.91 35.31,33.91 v36.83,33.91 | 22.75,22.97 20.45,20.66 20.45,7.24 | v47.12,33.15 52.58,38.61 v60.45,38.61 | v64.77,37.97 66.04,36.7 80.39,36.7 81.48,37.8 P2.16 | C3.1 22.52,22.97 22.75,22.97
  Top 0.813: v19.05,7.62 19,7.67
  Bottom 0.254: v78.39,83.28 78.2,83.28 77.34,82.42 U$5.28 | v86.74,82.17 87.29,81.62 U$5.7
  Bottom 0.508: v36.83,33.91 46.35,33.91 v47.12,33.15 | v60.45,38.61 64.14,38.61 v64.77,37.97
  pour Top (no thermals): 15.88,7.62 16.51,8.26 21.59,8.26 22.23,7.62 22.23,1.91 15.88,1.91
  pour Bottom (no thermals): 15.88,7.62 16.51,8.26 21.59,8.26 22.23,7.62 22.23,1.91 15.88,1.91
+5V  (via drill 0.35)
  Top 0.508: R14.2 28,29.65 IC3.3 | R14.2 40.19,26.04 43.05,26.04 48.03,21.06 C18.1 44.2,8.23 44.2,4.32 | 5VCONVERTER.8,VOUT(+) 5VCONVERTER.7,SENSE+ | 5VCONVERTER.8,VOUT(+) 50.31,67.94 R11.2 | 5VCONVERTER.8,VOUT(+) 42.29,59.92 42.29,45.59 | 42.29,45.59 42.29,37.59 36.58,31.88 R14.2 | 42.29,45.59 53.59,45.59 54.86,44.32 v54.99,44.45 | v57.28,43.05 62.74,43.05 v63.63,42.16 | v66.55,40.64 78.74,40.64 | 78.74,40.64 79.64,40.64 P2.15 | C16.1 77.83,41.55 78.74,40.64 | C17.1 77.83,39.73 78.74,40.64
  Bottom 0.508: v54.99,44.45 56.39,43.05 v57.28,43.05 | v63.63,42.16 65.15,40.64 v66.55,40.64
  pour Bottom (no thermals): 41.27,7.49 41.91,8.13 46.99,8.13 47.62,7.49 47.62,1.78 41.27,1.78
  pour Top (no thermals): 41.27,7.49 41.91,8.13 46.99,8.13 47.62,7.49 47.62,1.78 41.27,1.78
+12V  (via drill 0.35)
  Top 0.152: R15.2 66.58,63.12 Q22.2 | 51.98,89.57 53.41,89.57 R18.2
  Top 0.508: 12VCONVERTER.8,VOUT(+) 12VCONVERTER.7,SENSE+ | P2.9 83.45,69.6 88.9,69.6 90.81,67.69 90.81,65.91 97.41,59.31 v97.41,53.09
  Top 1.016: R13.2 59.05,46.92 59.05,74.55 63.94,79.44
  Top 1.27: 12VCONVERTER.8,VOUT(+) 51.98,89.57 55.83,85.72 57.66,85.72 63.94,79.44 70.72,72.67 C13.1 | C13.1 72.11,69.34 76.2,69.34 | P2.9 79.77,69.34 76.2,69.34 | C13.1 70.72,66 Q22.2 | C19.1 C21.1 | C21.1 C20.1 | C21.1 76.2,71.14 76.2,69.34
  Bottom 0.508: v97.41,53.09 97.41,52.79 D9.C D8.C
+24V  (via drill 0.35)
  Top 0.152: R9.2 66.92,55.79 Q6.2 | R43.2 67.56,47.41 68.28,46.69 | 67.77,46.69 Q18.2 | v69.85,61.21 69.85,55.25 69.47,54.87 | R20.2 73.15,23.18 73.15,24.72
  Top 1.016: C4.+ 70.27,24.72 73.15,24.72 D5.C D7.C 85.47,24.72 D3.C 90.13,24.85 90.26,24.98 D4.C D6.C D2.C
  Top 1.27: C4.+ 66.55,42.93 70.23,42.93 70.99,43.69 70.99,45.72 | 70.99,45.72 70.99,54.23 70.35,54.87 69.47,54.87 Q6.2 | 70.99,45.72 70.03,46.69 68.28,46.69 67.77,46.69
  Bottom 0.152: R5.1 69.85,64.22 v69.85,61.21
  Bottom 0.508: C4.+ 53.47,41.53 R21.2
  Bottom 1.27: C4.+ 58.3,35.69 D10.C
AGND  (via drill 0.35)
  Top 0.152: 12.1,79.25 R2.1 12.46,78.25 v12.45,78.23 | R7.1 12.94,52.72 v12.95,52.7 | R28.2 v55.37,55.24 | R29.2 v55.5,78.36 | ARMED.C 79.36,18.03 v79.38,18.03 | 3V3.C 24.63,20.32 v24.13,20.32 | 12V_LED.C 60.45,91.06 v60.83,90.68 | J1.S3 77.16,95.32 v77.09,95.25 77.09,92.44 J1.S4 J1.GND | J1.S1 86.16,95.32 v86.23,95.25 86.16,95.18 J1.S2 | 5V_LED.C 53.99,65.01 v54.1,64.9 | Q13.2 91.69,30.68 v91.69,30.61 | Q5.2 86.47,31.51 v87.38,30.61 | Q14.2 83.01,30.61 v83.19,30.61 | Q4.2 78.34,31.51 v78.99,30.86 | Q15.2 95.18,31.18 v95.89,30.48 | Q1.2 99.25,32.35 v99.08,32.51 | Q10.2 19.05,56.21 v19.05,55.88 | Q2.2 61.23,47.01 v61.21,46.99 | Q3.2 61.74,55.48 v62.48,54.74 | Q9.2 18.48,80.33 v19.3,79.5 | Q7.2 61.59,65.2 v61.59,64.01 | Q8.2 43.56,12.02 v43.56,11.18 | BATTERY.C 12.45,39.76 v12.45,40.64
  Top 0.254: C25.2 79.25,81.95 v79.25,81.15
  Top 0.508: C18.2 52.32,12.06 v52.7,12.45 | C16.2 73.53,43.84 v73.53,44.07 | C17.2 74.57,39.24 v73.41,39.24 | IC3.1 23.01,28.83 C3.2 21.57,26.92 v23.37,26.92
  Top 1.27: C20.2 C21.2 C19.2 73.18,74.4 v71.88,75.69
  Bottom 1.27: C4.- 59.05,25.53
  other vias: 26.67,7.62 36.83,7.49
  pour Bottom (no thermals): 102.87,103.35 102.87,9.91 -1.02,9.91 -1.02,102.62 -1.02,102.87 0,102.87
  pour Bottom: 23.5,7.62 23.5,10.54 29.84,10.54 29.84,7.24 23.5,7.24
  pour Bottom (no thermals): 23.5,7.62 24.13,8.26 29.21,8.26 29.84,7.62 29.84,1.91 23.5,1.91
  pour Top (no thermals): 23.5,7.62 24.13,8.26 29.21,8.26 29.84,7.62 29.84,1.91 23.5,1.91
  pour Bottom: 33.66,7.49 33.66,10.41 40.01,10.41 40.01,7.11 33.66,7.11
  pour Bottom (no thermals): 33.66,7.49 34.29,8.13 39.37,8.13 40.01,7.49 40.01,1.78 33.66,1.78
  pour Top (no thermals): 33.66,7.49 34.29,8.13 39.37,8.13 40.01,7.49 40.01,1.78 33.66,1.78
ARM_TORPEDO  (via drill 0.35)
  Top 0.152: v84.82,79.23 84.48,78.89 84.08,78.89 83.93,78.74 69.85,78.74 v68.07,76.96 | v66.17,75.31 61.47,70.61 v60.33,70.61 | v57.78,70.61 v43.05,70.61 | v39.5,70.36 27.3,58.17 U$6.P$3
  Bottom 0.152: U$5.10 84.83,79.22 v84.82,79.23 | v68.07,76.96 66.42,75.31 v66.17,75.31 | v60.33,70.61 v57.78,70.61 | v43.05,70.61 39.75,70.61 v39.5,70.36
COIL_1
  Top 0.508: D5.A 76.83,29.25 Q4.3 77.3,33.61 79.63,35.94 84.64,35.94 P2.8
COIL_1_GATE  (via drill 0.35)
  Top 0.152: v97.54,49.91 98.02,50.39 98.02,53.34 97.92,53.44 97.92,83.06 95.95,85.03 95.89,85.09 83.03,85.09 82.93,84.99 82.43,84.99 82.33,85.09 v81.79,85.09 | v94.44,46.82 91.31,43.69 v91.31,34.54 | v75.69,34.42 75.69,31.7 Q4.1
  Bottom 0.152: U$5.38 81.75,85.13 v81.79,85.09 | v97.54,49.91 v94.44,46.82 | v91.31,34.54 75.82,34.54 v75.69,34.42
COIL_2
  Top 0.508: D7.A 81.15,29.25 Q14.3 82.38,33.61 83.82,35.05 85.09,35.05 86.11,36.07 87.5,36.07 89.03,37.59 89.03,40.45 P2.7
COIL_2_GATE  (via drill 0.35)
  Top 0.152: v82.68,85.6 95.89,85.6 98.42,83.06 98.42,49.4 v98.19,49.16 | v95.12,46.1 91.69,42.67 91.69,36.7 92.71,35.69 v92.71,35.31 | v80.14,33.94 80.14,31.58 Q14.1
  Bottom 0.152: U$5.39 82.55,85.72 v82.68,85.6 | v98.19,49.16 v95.12,46.1 | v92.71,35.31 91.92,34.52 91.92,34.29 91.56,33.94 v80.14,33.94
COIL_3
  Top 0.508: D3.A 85.47,29.38 Q5.3 86.87,35.01 86.87,35.18 87.1,35.41 87.78,35.41 89.79,37.42 89.79,43.88 P2.6
COIL_3_GATE  (via drill 0.35)
  Top 0.152: v83.44,86.23 95.76,86.23 98.93,83.06 98.93,41.3 v99.21,41.02 | v83.69,33.33 83.69,32.34 Q5.1
  Bottom 0.152: U$5.40 83.35,86.32 v83.44,86.23 | v99.21,41.02 97.54,39.35 97.54,36.07 94.8,33.33 v83.69,33.33
COIL_4
  Top 0.508: D4.A 89.92,29.5 Q13.3 89.92,36.61 90.45,37.15 90.45,44.15 90.42,44.18 90.42,47.43 P2.5
COIL_4_GATE  (via drill 0.35)
  Top 0.152: v84.2,86.87 95.63,86.87 99.44,83.06 99.44,41.66 99.82,41.28 99.82,40.63 v99.19,40.01 | v87.88,32.72 87.88,32.59 Q13.1
  Bottom 0.152: U$5.41 84.2,88.17 v84.2,86.87 | v87.88,32.72 94.61,32.72 94.92,33.03 97.92,36.02 97.92,38.73 v99.19,40.01
COIL_5
  Top 0.508: D6.A 94.23,29.76 Q15.3 97.28,36.66 97.28,45.09 87.31,55.05 P2.4
COIL_5_GATE  (via drill 0.35)
  Top 0.152: v89.92,87.5 95.5,87.5 99.95,83.06 99.95,41.58 100.12,41.41 100.12,39.95 v99.16,38.99 | v92.08,32.12 92.68,32.12 Q15.1
  Bottom 0.152: U$5.2 89.31,85.62 89.92,86.23 v89.92,87.5 | v92.08,32.12 92.38,32.42 94.75,32.42 98.22,35.89 98.22,38.05 v99.16,38.99
COIL_S
  Top 0.508: D2.A 98.3,29.63 Q1.3 98.3,47.94 P2.3
COIL_S_GATE  (via drill 0.35)
  Top 0.152: v91.44,88.14 95.38,88.14 100.46,83.06 100.46,39.24 v99.19,37.97 | v96.9,32.64 96.9,31.96 Q1.1
  Bottom 0.152: U$5.3 89.9,84.82 91.44,86.36 v91.44,88.14 | v99.19,37.97 98.53,37.31 98.53,35.77 96.9,34.14 v96.9,32.64
DROPPER1  (via drill 0.35)
  Top 0.508: P2.10 83.58,65.53 88.65,65.53 v90.04,64.14
  Bottom 0.508: 90.97,63.2 Q17.3 | v90.04,64.14 90.97,63.2 | 90.97,63.2 90.97,63.16 89.41,61.59 89.28,61.59 89.28,57.06 D8.A
DROPPER1_GATE  (via drill 0.35)
  Top 0.152: v89.79,83.95 89.79,82.04 94.94,76.89 94.94,74.88 97.03,72.8 97.03,66.42 94.87,64.26 v94.11,64.26
  Bottom 0.152: U$5.4 89.71,84.02 v89.79,83.95 | v94.11,64.26 93.14,64.26 Q17.1
DROPPER2  (via drill 0.35)
  Top 0.508: P2.11 83.33,61.09 89.66,61.09 v90.42,60.33
  Bottom 0.508: D9.A 94.6,55.29 92.22,57.66 92.22,57.94 Q12.3 90.97,59.77 v90.42,60.33
DROPPER2_GATE  (via drill 0.35)
  Top 0.152: v90.42,82.8 90.42,81.84 95.25,77.01 95.25,75 97.33,72.92 97.33,64.95 v95.12,62.74
  Bottom 0.152: U$5.5 90,83.22 v90.42,82.8 | v95.12,62.74 95.12,62.18 Q12.1
MOBO_ON/OFF  (via drill 0.35)
  Top 0.152: v66.67,44.09 63.86,44.09 62.36,45.59 62.36,51.18 60.93,52.61 60.93,59.92 62.36,61.34 62.36,66.37 Q7.1 | v69.22,35.31 69.22,30.99 v67.44,29.21 | v66.17,26.42 66.17,11.68 v62.1,7.62
  Bottom 0.152: v66.67,44.09 69.22,41.55 v69.22,35.31 | v67.44,29.21 66.17,27.94 v66.17,26.42 | v62.1,7.62 62.1,3.52 U$1.19
MOBO_SWITCHED
  Top 1.27: Q22.3 79.25,61.3 79.25,56.01 80.2,55.05 P2.12
N$1
  Top 0.152: 12VCONVERTER.6,TRIM 55.39,83.74 R29.1
N$2
  Top 0.152: 5VCONVERTER.6,TRIM 55.39,60.24 R28.1
N$3
  Top 1.016: L3.2 12.87,92.54 C12.+ 21.7,91.95 12VCONVERTER.1,VIN(+)
N$4
  Bottom 0.152: U$5.19 80.95,75.4 R8.1 80.35,73.03 R5.2
N$5
  Top 0.152: R19.1 3V3.A
N$6
  Top 0.152: R11.1 55.59,66.14 5V_LED.A
N$7
  Top 1.016: L1.2 12.02,67.26 C2.+
  Bottom 1.016: C2.+ 12.6,67.84 5VCONVERTER.1,VIN(+)
N$8
  Top 0.152: R18.1 12V_LED.A
N$9
  Top 0.152: R10.1 14.79,38.92 BATTERY.A
N$10
  Top 0.152: ARMED.A 76.37,19.05 76.05,19.37 R20.1
N$11
  Top 0.152: R15.1 66.38,66.72 66.38,67.19 | C13.2 67.72,67.81 Q22.1 67.35,67.19 66.38,67.19 | 66.38,67.19 R16.2
N$12
  Top 0.152: R16.1 63.96,67.73 63.71,67.48 Q7.3
N$13
  Top 0.152: Q19.2 42.26,19.04 R45.2
  Top 1.016: R14.1 39.09,21.43 | 39.09,21.43 Q19.2 | R13.1 39.27,21.43 39.09,21.43
N$14
  Top 0.152: R44.1 64.17,49.99 Q2.3
N$15
  Top 0.152: RUN.C 72.94,82.52 R6.2
N$16
  Top 0.152: R45.1 42.29,15.16 42.02,14.88 | 39.47,14.86 Q19.1 41.62,14.48 42.02,14.88 | Q8.3 42.02,14.71 42.02,14.88
N$18
  Top 0.152: 12VCONVERTER.2,ON/OFF 18.25,83.74 Q9.3
N$19
  Top 0.152: Q10.3 18.63,60.24 5VCONVERTER.2,ON/OFF
N$20
  Top 0.152: R43.1 65.53,50.84 R44.2 Q18.1
N$22
  Bottom 0.152: C6.1 71.88,89.53 Q16.2 72.26,86.61 74.05,84.82 U$5.31
N$23
  Bottom 0.152: C1.1 71.88,80.64 Q16.1 76.02,84.02 U$5.30
N$24  (via drill 0.35)
  Top 0.152: R6.1 73.91,80.81 v73.91,80.39
  Bottom 0.152: U$5.23 75.88,78.42 v73.91,80.39
N$25
  Top 0.152: Q6.1 R12.2 65.53,59.09 R9.1
N$26
  Bottom 0.508: U$6.P$6 34.92,44.05 C5.1 44.41,41.51 R21.1
N$28
  Top 0.152: R12.1 64.17,58.25 63.84,57.91 Q3.3
N$32
  Bottom 0.152: C24.1 80.95,90.59 U$5.37
N$33
  Bottom 0.152: R42.1 85.6,74.17 84.15,75.62 U$5.15
PGC
  Bottom 0.152: U$5.16 83.35,75.4 85.22,73.53 87,73.53 87.98,72.55 JP1.4
PGD
  Bottom 0.152: U$5.17 82.55,75.18 85.72,72.01 JP1.3
PLTA_ON/OFF  (via drill 0.35)
  Top 0.152: v32.89,8.89 37.9,8.89 Q8.1
  Bottom 0.152: v32.89,8.89 31.75,7.75 31.75,3.94 31.77,3.92 U$1.7
PLTA_SWITCHED
  Top 1.016: Q19.3 31.77,16.74 U$1.50
PWM  (via drill 0.35)
  Top 0.152: v79.63,86.11 81.28,84.45 87.12,84.45 88.52,83.06 88.52,75.87 90.97,73.42 90.97,71.6 90.93,71.56 90.93,69.47 90.68,69.22 v90.68,69.09
  Bottom 0.152: U$5.35 79.35,86.39 v79.63,86.11 | v90.68,69.09 89.22,67.63 P2.1
SCL  (via drill 0.35)
  Top 0.152: v80.26,10.67 80.03,10.43 U$1.31
  Bottom 0.152: U$5.9 96.38,80.02 99.95,76.45 99.95,13.97 96.65,10.67 v80.26,10.67
SDA  (via drill 0.35)
  Top 0.152: U$1.32 77.49,3.56 77.47,3.57 v77.47,10.03
  Bottom 0.152: U$5.8 91.49,80.82 | 91.49,80.82 | 91.49,80.82 96.09,80.82 100.46,76.45 100.46,13.72 96.77,10.03 v77.47,10.03
TORPEDO1
  Top 1.27: Q18.3 77.37,46.67 P2.14
TORPEDO1_GATE  (via drill 0.35)
  Top 0.152: v85.98,78.36 84.93,78.36 84.71,78.58 84.2,78.58 83.98,78.36 70.87,78.36 v68.77,76.26 | v66.93,74.55 60.58,68.2 60.58,51 61.23,50.35 Q2.1
  Bottom 0.152: U$5.11 88.29,78.36 v85.98,78.36 | v68.77,76.26 67.06,74.55 v66.93,74.55
TORPEDO2
  Top 1.27: Q6.3 75.2,57.15 P2.13
TORPEDO2_GATE  (via drill 0.35)
  Top 0.152: v69.47,75.56 71.88,77.98 v84.45,77.98 | v67.69,73.79 62.87,68.96 62.87,65.15 63.63,64.39 63.63,60.83 61.74,58.94 Q3.1
  Bottom 0.152: U$5.14 84.95,77.48 v84.45,77.98 | v69.47,75.56 v67.69,73.79
USB+  (via drill 0.35)
  Top 0.152: v82.25,90.38 81.66,90.96 J1.D+
  Bottom 0.152: U$5.43 85.75,89.51 84.33,90.93 82.8,90.93 v82.25,90.38
USB-  (via drill 0.35)
  Top 0.152: v84.2,90.17 83.69,90.68 82.8,90.68 82.46,91.02 J1.D-
  Bottom 0.152: U$5.42 84.95,89.42 v84.2,90.17
V+
  Top 0.508: U$6.P$2 24.77,43.31 23.24,41.78 18.16,41.78
  pour Top: -0.51,101.6 -0.51,10.03 18.67,10.03 18.67,101.6

### Text on the board
tPlace: 12v | RUN | 5v | 3.3v | ARMED | The Underwater Robotics Team / Center for Automotive Research | Converter Board